# Altium schematic sheet Protection channel A. Page 2.SchDoc
size 420 x 297 mm; Address1: Address1; Address2: Address2; Address3: Address3; Address4: Address4; DocumentNumber: АБВГ.123456.001 Э3; SheetNumber: 2; SheetTotal: 7; Scale: 1:1; DocumentType: Схема электрическая принципиальная; FirstReferrence: АБВГ.123456.001
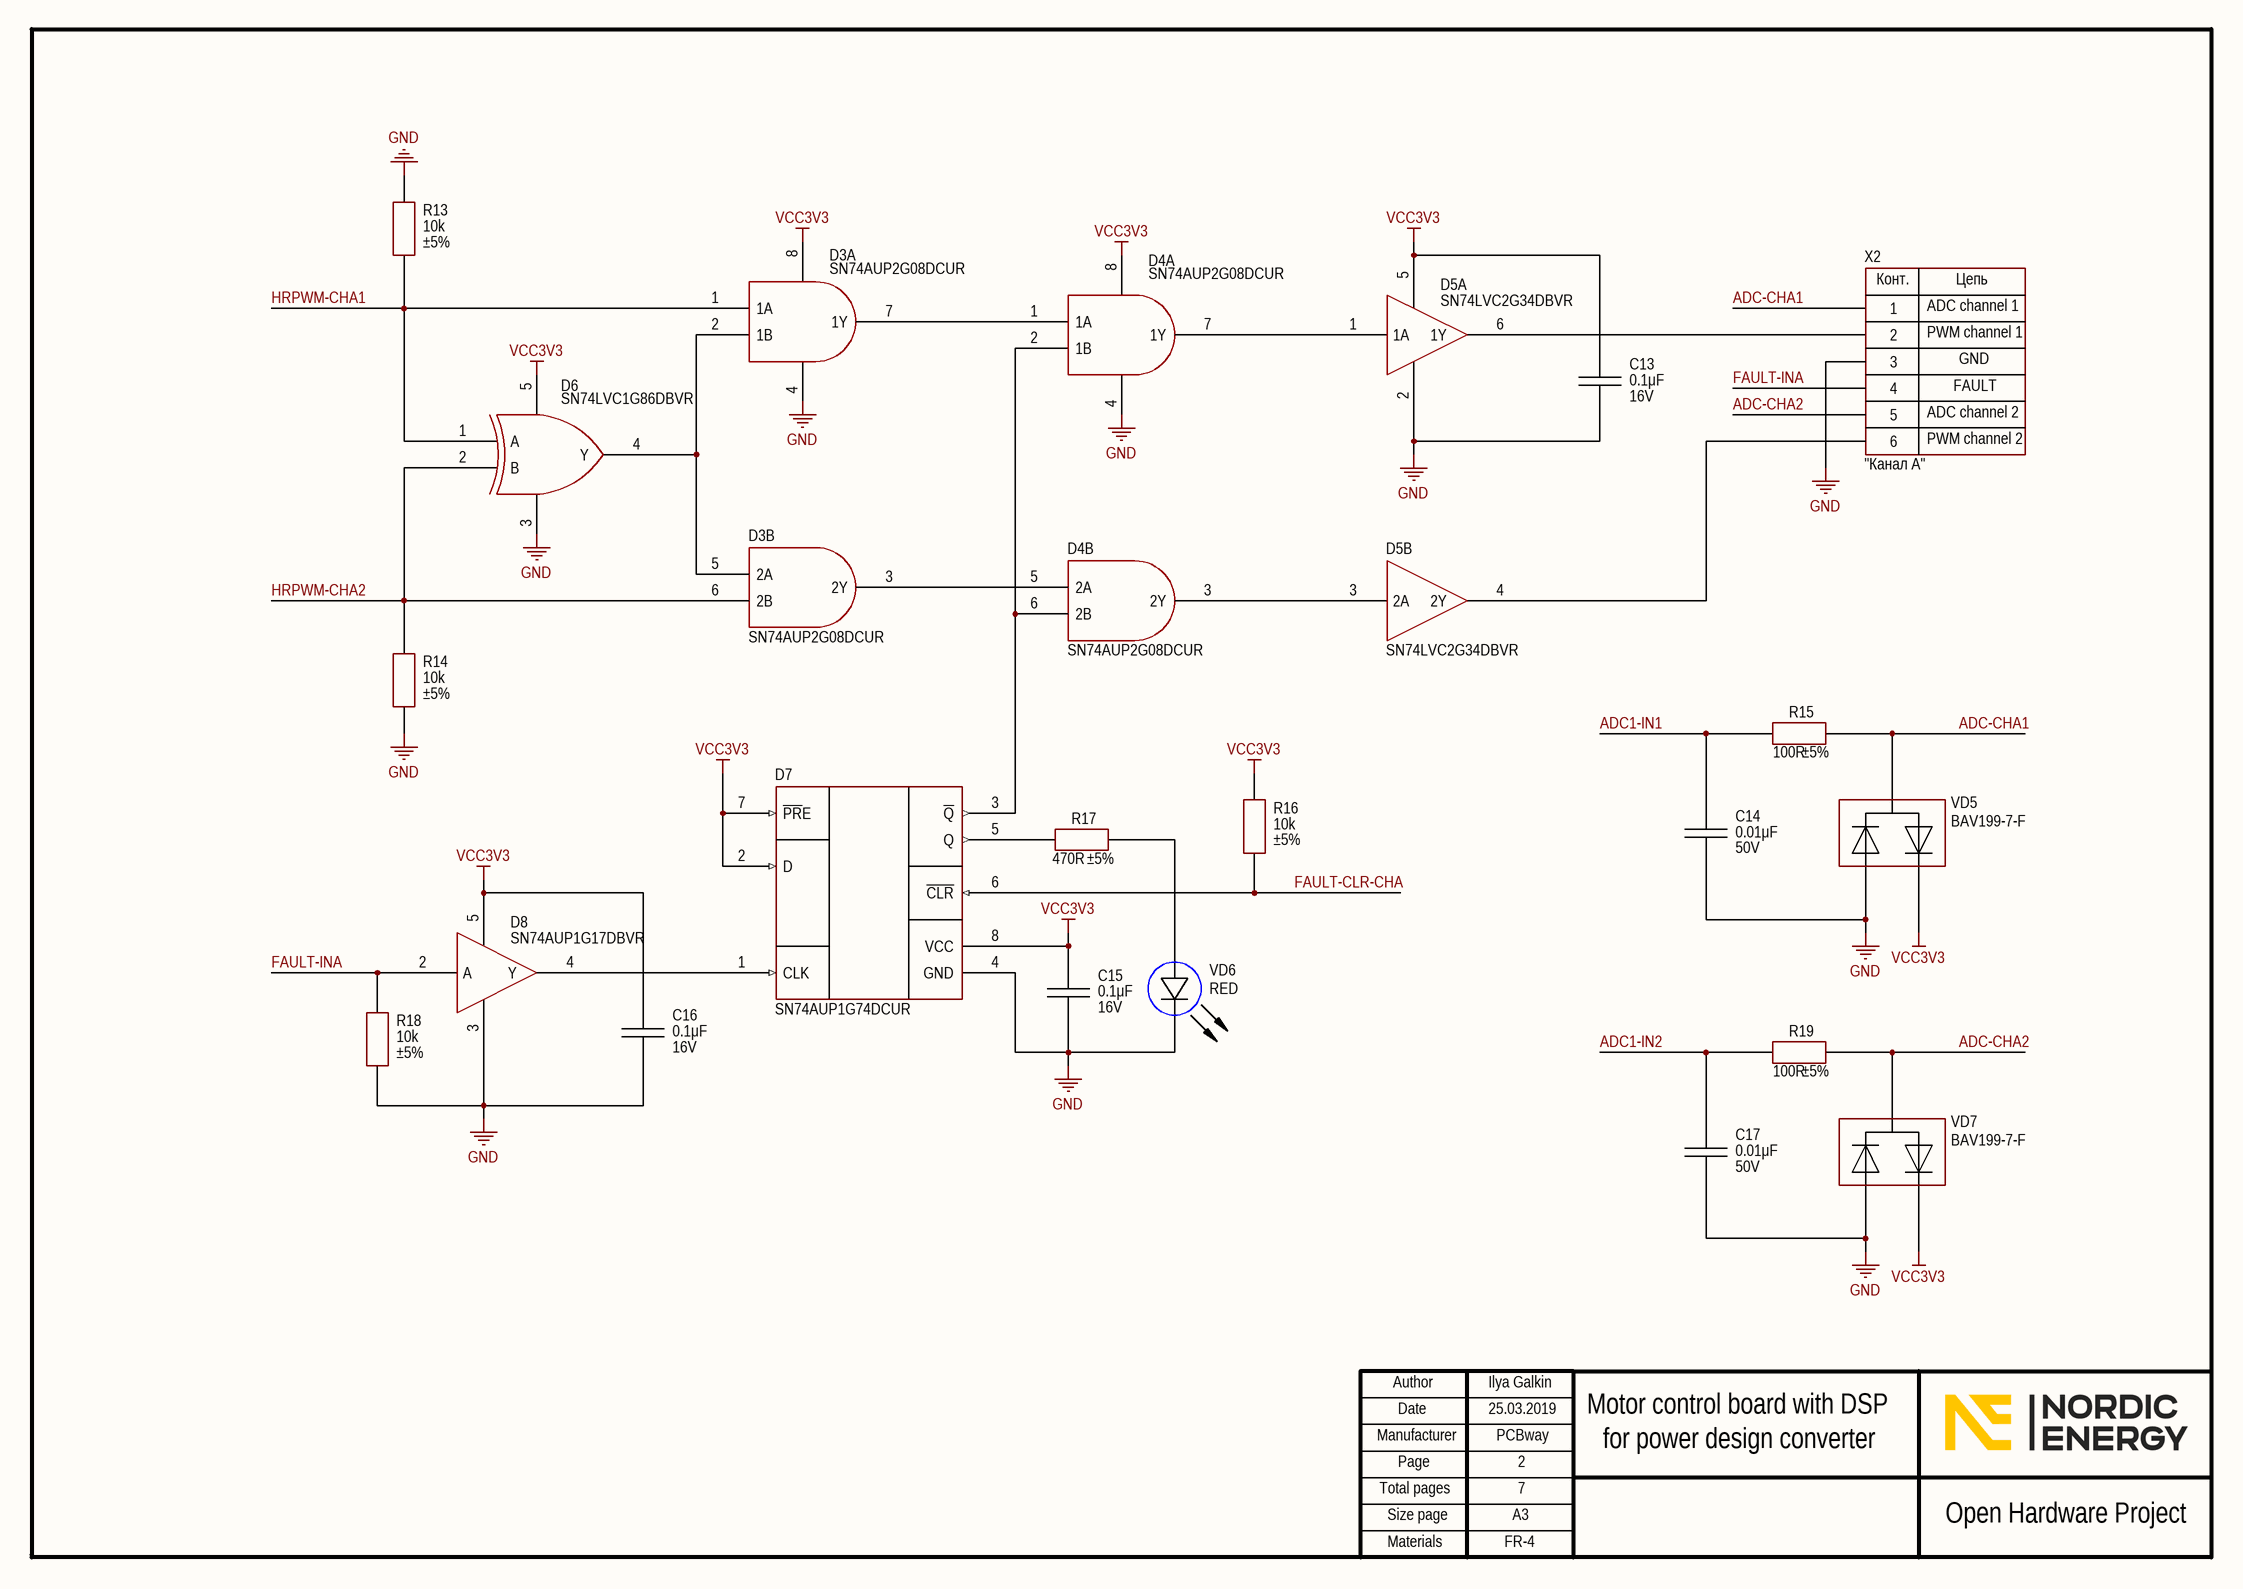
[diagram p0: Protection channel A. Page 2.SchDoc]

## Parts
C13  value 0.1μF  Voltage: 16V  [CAP: 0805]
C14  value 0.01μF  Voltage: 50V  [CAP: 0805]
C15  value 0.1μF  Voltage: 16V  [CAP: 0805]
C16  value 0.1μF  Voltage: 16V  [CAP: 0805]
C17  value 0.01μF  Voltage: 50V  [CAP: 0805]
D3  (no value)  [8-VSSOP]  (parts A,B of 2)
D4  (no value)  [8-VSSOP]  (parts A,B of 2)
D5  (no value)  [SOT23-6]  (parts A,B of 2)
D6  (no value)  [SOT23-5]
D7  (no value)  [8-VSSOP]
D8  (no value)  [SOT23-5]
R13  value 10k  Tolerance: ±5%  [RES: 0805]
R14  value 10k  Tolerance: ±5%  [RES: 0805]
R15  value 100R  Tolerance: ±5%  [RES: 0805]
R16  value 10k  Tolerance: ±5%  [RES: 0805]
R17  value 470R  Tolerance: ±5%  [RES: 0805]
R18  value 10k  Tolerance: ±5%  [RES: 0805]
R19  value 100R  Tolerance: ±5%  [RES: 0805]
VD5  PartNumber: BAV199-7-F  [SOT23]
VD6  Color: RED  [LED: 0805R]
VD7  PartNumber: BAV199-7-F  [SOT23]
X2  CommentText: "Канал А"  [CON: PLD-6]

## Nets
GND: C13.1 C14.1 C15.1 C16.1 C17.1 D3.4 D4.4 D5.2 D6.3 D7.4(GND) D8.3 R13.1 R14.2 R18.2 VD5.1 VD6.2(C) VD7.1 X2.3
VCC3V3: C13.2 C15.2 C16.2 D3.8 D4.8 D5.5 D6.5 D7.2(D) D7.7(~{PR}E) D7.8(VCC) D8.5 R16.1 VD5.2 VD7.2
ADC1-IN1: C14.2 R15.1
ADC1-IN2: C17.2 R19.1
ADC-CHA1: R15.2 VD5.3 X2.1
ADC-CHA2: R19.2 VD7.3 X2.5
FAULT-CLR-CHA: D7.6(~{CLR}) R16.2
FAULT-INA: D8.2(A) R18.1 X2.4
HRPWM-CHA1: D3.1(1A) D6.1(A) R13.2
HRPWM-CHA2: D3.6(2B) D6.2(B) R14.1
NetD3_2: D3.2(1B) D3.5(2A) D6.4(Y)
NetD3_3: D3.3(2Y) D4.5(2A)
NetD3_7: D3.7(1Y) D4.1(1A)
NetD4_2: D4.2(1B) D4.6(2B) D7.3(~{Q})
NetD4_3: D4.3(2Y) D5.3(2A)
NetD4_7: D4.7(1Y) D5.1(1A)
NetD5_4: D5.4(2Y) X2.6
NetD5_6: D5.6(1Y) X2.2
NetD7_1: D7.1(CLK) D8.4(Y)
NetD7_5: D7.5(Q) R17.2
NetR17_1: R17.1 VD6.1(A)

## Notes on the sheet
- ADC channel 1
- PWM channel 1
- FAULT
- GND
- ADC channel 2
- PWM channel 2
- Ilya Galkin
- 25.03.2019
- PCBway
- 2
- Motor control board with DSP
- for power design converter
- 7
- FR-4
- Author
- Manufacturer
- Date
- Page
- Total pages
- Size page
- A3
- Open Hardware Project
- Materials
- (in symbol PLD-6) Конт.; Цепь

## Library data of the parts
C13 C15 C16 = Ceramic_0805: Manufacturer: Yageo; PartNumber: CC0805KRX7R7BB104; ValueManufacturerPartNumber: Ceramic capacitor, 0.1μF, X7R, ±10%, 16V, 0805, -55...+125°C; TypeCapacitor: Ceramic capacitor; Tolerance: ±10%; TypeDielectric: X7R; Package: 0805; HelpURL: https://www.digikey.com/product-detail/en/yageo/CC0805KRX7R7BB104/311-1142-1-ND/303052; Temperature: -55...+125°C
C14 C17 = Ceramic_0805: Manufacturer: Yageo; PartNumber: CC0805KRX7R9BB103; ValueManufacturerPartNumber: Ceramic capacitor, 0.01μF, X7R, ±10%, 50V, 0805, -55...+125°C; TypeCapacitor: Ceramic capacitor; Tolerance: ±10%; TypeDielectric: X7R; Package: 0805; HelpURL: https://www.digikey.com/product-detail/en/yageo/CC0805KRX7R9BB103/311-1136-1-ND/303046; Temperature: -55...+125°C
D3 D4 = SN74AUP2G08DCUR: AND; Manufacturer: Texas Instruments; ValueManufacturerPartNumber: IC logic AND, 0.8...3.6V, -40...+855°C, 8-VSSOP; Supply: 0.8...3.6V; HelpURL: https://www.digikey.com/product-detail/en/texas-instruments/SN74AUP2G08DCUR/296-32271-1-ND/3505517; Package: 8-VSSOP; ComponentType: IC logic AND; Temperature: -40...+855°C; PartNumber: SN74AUP2G08DCUR
D5 = SN74LVC2G34DBVR: Buffer; Manufacturer: Texas Instruments; ValueManufacturerPartNumber: IC logic buffer, 1.65...5.5V, -40...+125°C, SOT23-6; Supply: 1.65...5.5V; HelpURL: https://www.digikey.com/product-detail/en/texas-instruments/SN74LVC2G34DBVR/296-13496-1-ND/486431; Package: SOT23-6; ComponentType: IC logic buffer; Temperature: -40...+125°C; PartNumber: SN74LVC2G34DBVR
D6 = SN74LVC1G86DBVR: XOR; Manufacturer: Texas Instruments; ValueManufacturerPartNumber: IC logic XOR, 1.65...5.5V, -40...+125°C, SOT23-5; Supply: 1.65...5.5V; HelpURL: https://www.digikey.com/product-detail/en/texas-instruments/SN74LVC1G86DBVR/296-9853-1-ND/380077; Package: SOT23-5; ComponentType: IC logic XOR; Temperature: -40...+125°C; PartNumber: SN74LVC1G86DBVR
D7 = SN74AUP1G74DCUR: D-trigger; Manufacturer: Texas Instruments; ValueManufacturerPartNumber: ICtrigger D-type, 0.8...3.6V, -40...+85°C, 8-VSSOP; Supply: 0.8...3.6V; HelpURL: https://www.digikey.com/product-detail/en/texas-instruments/SN74AUP1G74DCUR/296-19761-1-ND/1091423; Package: 8-VSSOP; ComponentType: ICtrigger D-type; Temperature: -40...+85°C; PartNumber: SN74AUP1G74DCUR
D8 = SN74AUP1G17DBVR: Schmitt trigger; Manufacturer: Texas Instruments; ValueManufacturerPartNumber: IC Schmitt trigger, 0.8...3.6V, -40...+85°C, SOT23-6; Supply: 0.8...3.6V; HelpURL: https://www.digikey.com/product-detail/en/texas-instruments/SN74AUP1G17DBVR/296-19077-1-ND/864308; Package: SOT23-6; ComponentType: IC Schmitt trigger; Temperature: -40...+85°C; PartNumber: SN74AUP1G17DBVR
R13 R14 R16 R18 = Resistor_0805: Manufacturer: Yageo; PartNumber: RC0805JR-0710KL; ValueManufacturerPartNumber: Resistor film, 10k, ±5%, 0805, 0.125W, -55...+125°C; TypeResistor: Resistor film; Power: 0.125W; Package: 0805; HelpURL: https://www.digikey.com/product-detail/en/yageo/RC0805JR-0710KL/311-10KARCT-ND/731188; Temperature: -55...+125°C
R15 R19 = Resistor_0805: Manufacturer: Yageo; PartNumber: RC0805JR-07100RL; ValueManufacturerPartNumber: Resistor film, 100R, ±5%, 0805, 0.125W, -55...+125°C; TypeResistor: Resistor film; Power: 0.125W; Package: 0805; HelpURL: https://www.digikey.com/product-detail/en/yageo/RC0805JR-07100RL/311-100ARCT-ND/731185; Temperature: -55...+125°C
R17 = Resistor_0805: Manufacturer: Yageo; PartNumber: RC0805JR-07470RL; ValueManufacturerPartNumber: Resistor film, 470R, ±5%, 0805, 0.125W, -55...+125°C; TypeResistor: Resistor film; Power: 0.125W; Package: 0805; HelpURL: https://www.digikey.com/product-detail/en/yageo/RC0805JR-07470RL/311-470ARCT-ND/731280; Temperature: -55...+125°C
VD5 VD7 = Diode_array: Manufacturer: Diodes Incorporated; ValueManufacturerPartNumber: Diode array, 85V, 140mA, 1.1V, 3us, SOT-23, -65...+150°C; TypeDiode: Diode array; Voltage: 85V; Current: 140mA; VoltageDrop: 1.1V; RecoveryTime: 3us; Package: SOT-23; HelpURL: https://www.digikey.com/product-detail/en/diodes-incorporated/BAV199-7-F/BAV199-FDICT-ND/1033647; Temperature: -65...+150°C
VD6 = LED_single: Manufacturer: Wurth; ValueManufacturerPartNumber: LED, 20mA, 2V, 0805, -55...+150°C; PartNumber: 150080RS75000; TypeDiode: LED; Current: 20mA; VoltageDrop: 2V; Package: 0805; HelpURL: https://www.digikey.com/product-detail/en/wurth-electronics-inc/150080RS75000/732-4984-1-ND/4489916; Temperature: -55...+150°C
X2 = PLD-6: Manufacturer: Connfly; ValueManufacturerPartNumber: Connector, 6pin, 2.54mm, 500VAC, 3A; TypeConnector: Connector; VoltageMax: 500VAC; Pitch: 2.54mm; CurrentMax: 3A; Multichannel: 6pin; HelpURL: https://www.chipdip.ru/product/pld-6; PartNumber: PLD-6